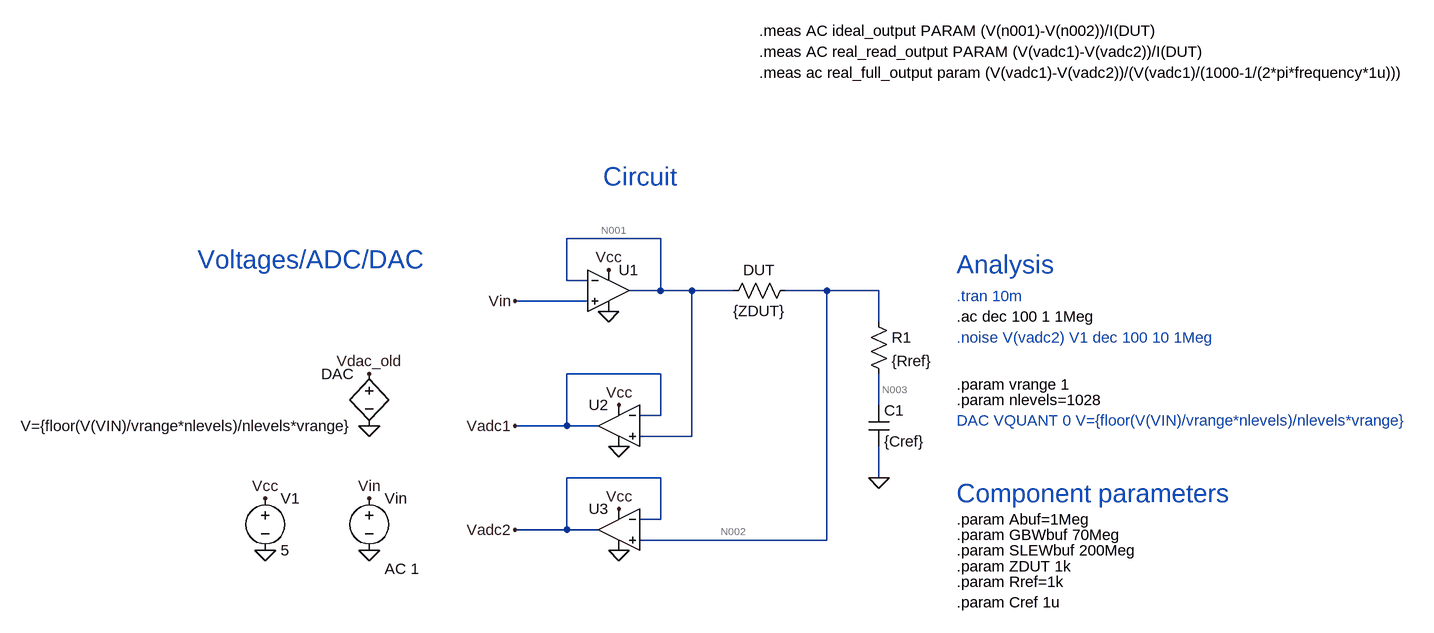
[diagram p0: schematic IV.asc]
IV.asc, the LTspice schematic file:
Version 4
SHEET 1 1556 944
WIRE 224 208 80 208
WIRE 80 272 80 208
WIRE 112 272 80 272
WIRE 224 288 224 208
WIRE 224 288 176 288
WIRE 272 288 224 288
WIRE 336 288 272 288
WIRE 480 288 416 288
WIRE 560 288 480 288
WIRE 112 304 0 304
WIRE 560 336 560 288
WIRE 224 416 80 416
WIRE 560 464 560 416
WIRE 224 480 224 416
WIRE 224 480 192 480
WIRE 80 496 80 416
WIRE 80 496 0 496
WIRE 128 496 80 496
WIRE 272 512 272 288
WIRE 272 512 192 512
WIRE 224 576 80 576
WIRE 560 576 560 528
WIRE 224 640 224 576
WIRE 224 640 192 640
WIRE 80 656 80 576
WIRE 80 656 0 656
WIRE 128 656 80 656
WIRE 480 672 480 288
WIRE 480 672 192 672
FLAG -224 688 0
FLAG -384 688 0
FLAG -384 608 Vcc
FLAG -224 608 Vin
FLAG 144 320 0
FLAG 144 256 Vcc
FLAG 0 304 Vin
FLAG -224 496 0
FLAG -224 416 Vdac_old
FLAG 560 576 0
FLAG 160 528 0
FLAG 160 464 Vcc
FLAG 160 688 0
FLAG 160 624 Vcc
FLAG 0 496 Vadc1
FLAG 0 656 Vadc2
SYMBOL voltage -384 592 R0
SYMATTR InstName V1
SYMATTR Value 5
SYMBOL voltage -224 592 R0
WINDOW 123 24 124 Left 2
WINDOW 39 24 152 Left 2
SYMATTR Value2 AC 1
SYMATTR InstName Vin
SYMATTR Value ""
SYMBOL OpAmps\\UniversalOpAmp2 144 288 R0
SYMATTR InstName U1
SYMATTR Value2 Avol=Abuf GBW=GBWbuf Slew=SLEWbuf
SYMATTR SpiceLine Ilimit=40m Rail=0 Vos=0
SYMBOL bv -224 400 M0
SYMATTR InstName DAC
SYMATTR Value V={floor(V(VIN)/vrange*nlevels)/nlevels*vrange}
SYMBOL res 432 272 R90
WINDOW 0 0 56 VBottom 2
WINDOW 3 32 56 VTop 2
SYMATTR InstName DUT
SYMATTR Value {ZDUT}
SYMBOL res 544 320 R0
SYMATTR InstName R1
SYMATTR Value {Rref}
SYMBOL OpAmps\\UniversalOpAmp2 160 496 M0
SYMATTR InstName U2
SYMATTR Value2 Avol=Abuf GBW=GBWbuf Slew=SLEWbuf
SYMATTR SpiceLine Ilimit=40m Rail=0 Vos=0
SYMBOL OpAmps\\UniversalOpAmp2 160 656 M0
SYMATTR InstName U3
SYMATTR Value2 Avol=Abuf GBW=GBWbuf Slew=SLEWbuf
SYMATTR SpiceLine Ilimit=40m Rail=0 Vos=0
SYMBOL cap 544 464 R0
SYMATTR InstName C1
SYMATTR Value {Cref}
TEXT 680 640 Left 2 !.param Abuf=1Meg
TEXT 680 664 Left 2 !.param GBWbuf 70Meg
TEXT 680 688 Left 2 !.param SLEWbuf 200Meg
TEXT 680 432 Left 2 !.param vrange 1
TEXT 680 456 Left 2 !.param nlevels=1028
TEXT 680 488 Left 2 ;DAC VQUANT 0 V={floor(V(VIN)/vrange*nlevels)/nlevels*vrange}
TEXT 680 296 Left 2 ;.tran 10m
TEXT 680 328 Left 2 !.ac dec 100 1 1Meg
TEXT 680 712 Left 2 !.param ZDUT 1k
TEXT 680 360 Left 2 ;.noise V(vadc2) V1 dec 100 10 1Meg
TEXT 680 248 Left 4 ;Analysis
TEXT 680 600 Left 4 ;Component parameters
TEXT 136 112 Left 4 ;Circuit
TEXT -488 240 Left 4 ;Voltages/ADC/DAC
TEXT 376 -112 Left 2 !.meas AC ideal_output PARAM (V(n001)-V(n002))/I(DUT)
TEXT 680 736 Left 2 !.param Rref=1k
TEXT 680 768 Left 2 !.param Cref 1u
TEXT 376 -80 Left 2 !.meas AC real_read_output PARAM (V(vadc1)-V(vadc2))/I(DUT)
TEXT 376 -48 Left 2 !.meas ac real_full_output param (V(vadc1)-V(vadc2))/(V(vadc1)/(1000-1/(2*pi*frequency*1u)))

The netlist it stands for:
* IV.asc
V1 Vcc 0 5
Vin Vin 0 AC 1
XU1 Vin N001 Vcc 0 N001 level2 Avol=Abuf GBW=GBWbuf Slew=SLEWbuf Ilimit=40m Rail=0 Vos=0 En=0 Enk=0 In=0 Ink=0 Rin=500Meg  ; pins In+ In- V+ V- OUT
B§DAC Vdac_old 0 V={floor(V(VIN)/vrange*nlevels)/nlevels*vrange}
R§DUT N002 N001 {ZDUT}
R1 N002 N003 {Rref}
XU2 N001 Vadc1 Vcc 0 Vadc1 level2 Avol=Abuf GBW=GBWbuf Slew=SLEWbuf Ilimit=40m Rail=0 Vos=0 En=0 Enk=0 In=0 Ink=0 Rin=500Meg  ; pins In+ In- V+ V- OUT
XU3 N002 Vadc2 Vcc 0 Vadc2 level2 Avol=Abuf GBW=GBWbuf Slew=SLEWbuf Ilimit=40m Rail=0 Vos=0 En=0 Enk=0 In=0 Ink=0 Rin=500Meg  ; pins In+ In- V+ V- OUT
C1 N003 0 {Cref}
.param Abuf=1Meg
.param GBWbuf 70Meg
.param SLEWbuf 200Meg
.param vrange 1
.param nlevels=1028
* DAC VQUANT 0 V={floor(V(VIN)/vrange*nlevels)/nlevels*vrange}
* .tran 10m
.ac dec 100 1 1Meg
.param ZDUT 1k
* .noise V(vadc2) V1 dec 100 10 1Meg
* Analysis
* Component parameters
* Circuit
* Voltages/ADC/DAC
.meas AC ideal_output PARAM (V(n001)-V(n002))/I(DUT)
.param Rref=1k
.param Cref 1u
.meas AC real_read_output PARAM (V(vadc1)-V(vadc2))/I(DUT)
.meas ac real_full_output param (V(vadc1)-V(vadc2))/(V(vadc1)/(1000-1/(2*pi*frequency*1u)))
.lib UniversalOpAmp2.lib
.backanno
.end

* Results of the author's LTspice run, read from the files saved beside the schematic
* Operating Point, zero values left out:
*   V(vcc) = 5 V
*   V(n001) = 319 µV
*   V(n002) = 324 µV
*   V(n003) = 324 µV
*   V(vadc1) = 555.1 µV
*   V(vadc2) = 559.2 µV
*   I(Dut) = 4.999 nA
*   I(V1) = -14.64 µA
*   I(Vin) = 5 nA
*   Ix(u1:1) = -5 nA
*   Ix(u1:2) = -4.999 nA
*   Ix(u1:3) = 4.022 µA
*   Ix(u1:4) = -4 µA
*   Ix(u1:5) = 15 nA
*   Ix(u2:1) = -4.999 nA
*   Ix(u2:2) = -4.999 nA
*   Ix(u2:3) = 5.302 µA
*   Ix(u2:4) = -5.27 µA
*   Ix(u2:5) = 4.999 nA
*   Ix(u3:1) = -4.999 nA
*   Ix(u3:2) = -4.999 nA
*   Ix(u3:3) = 5.321 µA
*   Ix(u3:4) = -5.289 µA
*   Ix(u3:5) = 4.999 nA
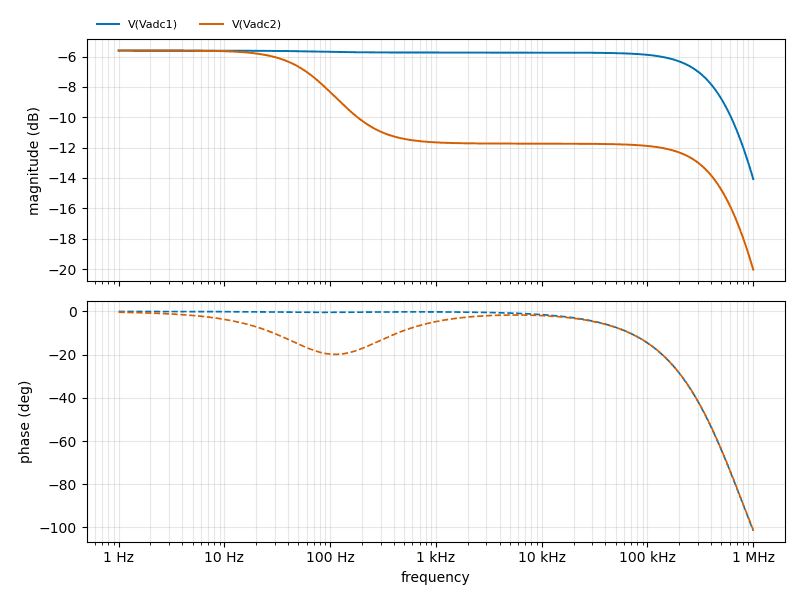
[diagram p1: AC Analysis of IV.asc, plotted from the saved traces]
* AC Analysis, 1 run:
*   V(Vadc1): -5.61 dB at 1 Hz, -14.07 dB at 1 MHz, peak -5.61 dB at 1 Hz, 3 dB below the peak at 482.6 kHz
*   V(Vadc2): -5.60 dB at 1 Hz, -20.04 dB at 1 MHz, peak -5.60 dB at 1 Hz, 3 dB below the peak at 109.5 Hz
* From the log:
*   ideal_output: (v(n001)-v(n002))/i(dut)=(60dB,180°)
*   real_read_output: (v(vadc1)-v(vadc2))/i(dut)=(55.498dB,136.735°)
*   real_full_output: (v(vadc1)-v(vadc2))/(v(vadc1)/(1000-1/(2*pi*frequency*1u)))=(53.9274dB,-0.223303°)